# Altium schematic sheet uC_Board.SchDoc
size Legal
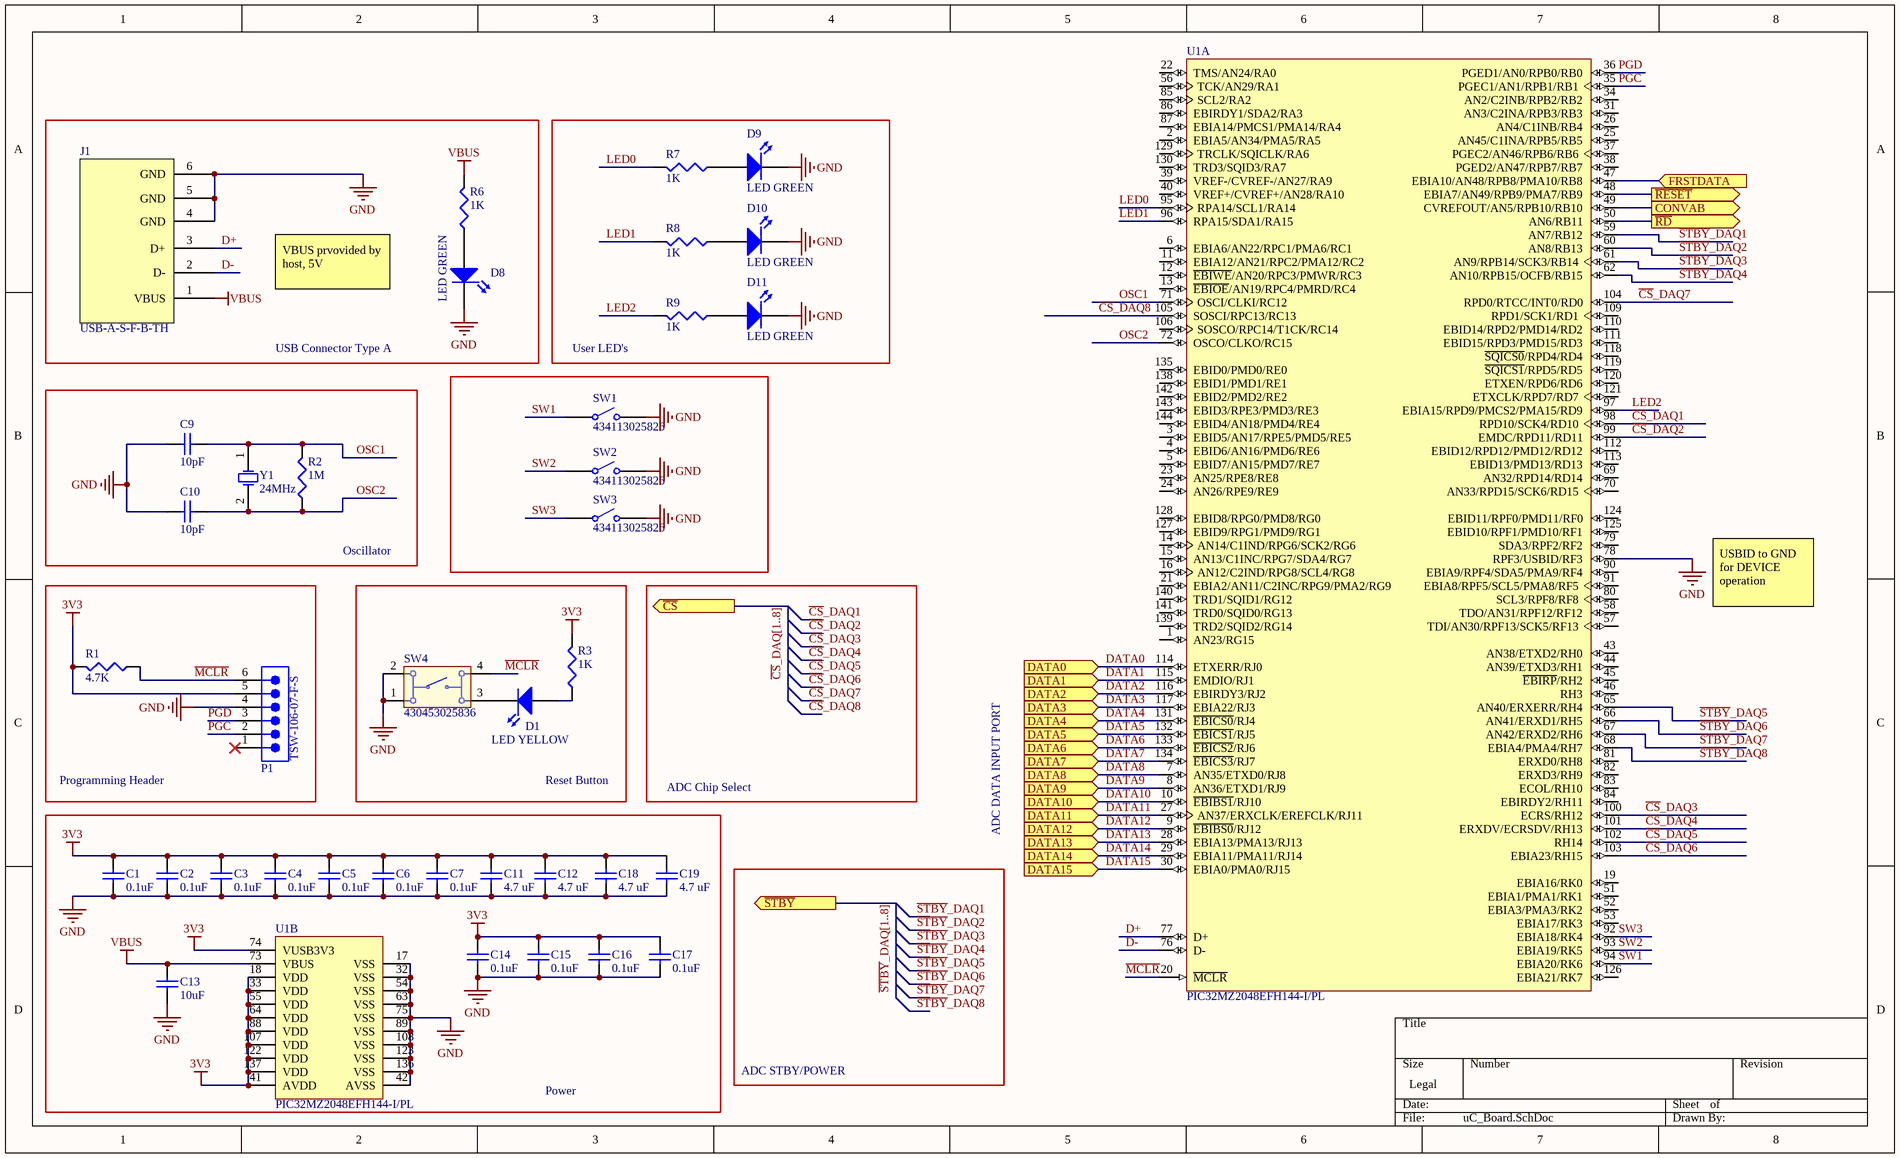
[diagram p0: uC_Board.SchDoc]

## Parts
C1  value 0.1uF  [0402]  (hidden comment: C0402)
C2  value 0.1uF  [0402]  (hidden comment: C0402)
C3  value 0.1uF  [0402]  (hidden comment: C0402)
C4  value 0.1uF  [0402]  (hidden comment: C0402)
C5  value 0.1uF  [0402]  (hidden comment: C0402)
C6  value 0.1uF  [0402]  (hidden comment: C0402)
C7  value 0.1uF  [0402]  (hidden comment: C0402)
C9  value 10pF  [0805]  (hidden comment: C0805)
C10  value 10pF  [0805]  (hidden comment: C0805)
C11  value 4.7 uF  [0603]  (hidden comment: C0603)
C12  value 4.7 uF  [0603]  (hidden comment: C0603)
C13  value 10uF  [0805]  (hidden comment: C0805)
C14  value 0.1uF  [0402]  (hidden comment: C0402)
C15  value 0.1uF  [0402]  (hidden comment: C0402)
C16  value 0.1uF  [0402]  (hidden comment: C0402)
C17  value 0.1uF  [0402]  (hidden comment: C0402)
C18  value 4.7 uF  [0603]  (hidden comment: C0603)
C19  value 4.7 uF  [0603]  (hidden comment: C0603)
D1  LED YELLOW  [C0805]
D8  LED GREEN  [C0805]
D9  LED GREEN  [C0805]
D10  LED GREEN  [C0805]
D11  LED GREEN  [C0805]
J1  USB-A-S-F-B-TH  [USB-A Connector]
P1  TSW-106-07-F-S  [SMTC-TSW-106-07-X-S]
R1  value 4.7K  [J1-0603]  (hidden comment: Res3)
R2  value 1M  [0402]  (hidden comment: Res3)
R3  value 1K  [0402]  (hidden comment: Res3)
R6  value 1K  [0402]  (hidden comment: Res3)
R7  value 1K  [0402]  (hidden comment: Res3)
R8  value 1K  [0402]  (hidden comment: Res3)
R9  value 1K  [0402]  (hidden comment: Res3)
SW1  434113025826  [434113025826]
SW2  434113025826  [434113025826]
SW3  434113025826  [434113025826]
SW4  430453025836  [430453025836]
U1  PIC32MZ2048EFH144-I/PL  [MCHP-LQFP-PL144_N]  (parts A,B of 2)
Y1  24MHz  [HC49US]

## Blocks framed on the sheet
USB Connector Type A: D8 J1 R6
User LED's: D9-D11 R7-R9
Oscillator: C9 C10 R2 Y1
Programming Header: P1 R1
Reset Button: D1 R3 SW4
Power: C1-C7 C11-C19 U1

## Ports
CONVAB (out), DATA0 (in), DATA1 (in), DATA2 (in), DATA3 (in), DATA4 (in), DATA5 (in), DATA6 (in), DATA7 (in), DATA8 (in), DATA9 (in), DATA10 (in), DATA11 (in), DATA12 (in), DATA13 (in), DATA14 (in), DATA15 (in), FRSTDATA (in), ~{CS} (out), ~{RD} (out), ~{RESET} (out), ~{STBY} (out)

## Nets
3V3: C1.2 C2.2 C3.2 C4.2 C5.2 C6.2 C7.2 C11.1 C12.1 C14.2 C15.2 C16.2 C17.2 C18.1 C19.1 P1.5 R1.2 R3.2 U1.18(VDD) U1.33(VDD) U1.41(AVDD) U1.55(VDD) U1.64(VDD) U1.74(VUSB3V3) U1.88(VDD) U1.107(VDD) U1.122(VDD) U1.137(VDD)
GND: C1.1 C2.1 C3.1 C4.1 C5.1 C6.1 C7.1 C9.1 C10.1 C11.2 C12.2 C13.1 C14.1 C15.1 C16.1 C17.1 C18.2 C19.2 D8.2(K) D9.2(K) D10.2(K) D11.2(K) J1.4(GND) J1.5(GND) J1.6(GND) P1.4 SW1.2 SW2.2 SW3.2 SW4.1 SW4.2 U1.17(VSS) U1.32(VSS) U1.42(AVSS) U1.54(VSS) U1.63(VSS) U1.75(VSS) U1.78(RPF3/USBID/RF3) U1.89(VSS) U1.108(VSS) U1.123(VSS) U1.136(VSS)
VBUS: C13.2 J1.1(VBUS) R6.2 U1.73(VBUS)
~{CS}_DAQ1: U1.98(RPD10/SCK4/RD10)
~{CS}_DAQ2: U1.99(EMDC/RPD11/RD11)
~{CS}_DAQ3: U1.100(ECRS/RH12)
~{CS}_DAQ4: U1.101(ERXDV/ECRSDV/RH13)
~{CS}_DAQ5: U1.102(RH14)
~{CS}_DAQ6: U1.103(EBIA23/RH15)
~{CS}_DAQ7: U1.104(RPD0/RTCC/INT0/RD0)
~{CS}_DAQ8: U1.105(SOSCI/RPC13/RC13)
~{CS}_DAQ[1..8]: port ~{CS}
CONVAB: U1.49(CVREFOUT/AN5/RPB10/RB10) ; port CONVAB
D+: J1.3(D+) U1.77(D+)
D-: J1.2(D-) U1.76(D-)
DATA0: U1.114(ETXERR/RJ0) ; port DATA0
DATA1: U1.115(EMDIO/RJ1) ; port DATA1
DATA2: U1.116(EBIRDY3/RJ2) ; port DATA2
DATA3: U1.117(EBIA22/RJ3) ; port DATA3
DATA4: U1.131(~{EBICS0}/RJ4) ; port DATA4
DATA5: U1.132(~{EBICS1}/RJ5) ; port DATA5
DATA6: U1.133(~{EBICS2}/RJ6) ; port DATA6
DATA7: U1.134(~{EBICS3}/RJ7) ; port DATA7
DATA8: U1.7(AN35/ETXD0/RJ8) ; port DATA8
DATA9: U1.8(AN36/ETXD1/RJ9) ; port DATA9
DATA10: U1.10(~{EBIBS1}/RJ10) ; port DATA10
DATA11: U1.27(AN37/ERXCLK/EREFCLK/RJ11) ; port DATA11
DATA12: U1.9(~{EBIBS0}/RJ12) ; port DATA12
DATA13: U1.28(EBIA13/PMA13/RJ13) ; port DATA13
DATA14: U1.29(EBIA11/PMA11/RJ14) ; port DATA14
DATA15: U1.30(EBIA0/PMA0/RJ15) ; port DATA15
FRSTDATA: U1.47(EBIA10/AN48/RPB8/PMA10/RB8) ; port FRSTDATA
LED0: R7.2 U1.95(RPA14/SCL1/RA14)
LED1: R8.2 U1.96(RPA15/SDA1/RA15)
LED2: R9.2 U1.97(EBIA15/RPD9/PMCS2/PMA15/RD9)
~{MCLR}: P1.6 R1.1 SW4.4 U1.20(~{MCLR})
OSC1: C9.2 R2.2 U1.71(OSCI/CLKI/RC12) Y1.1(OSC1)
OSC2: C10.2 R2.1 U1.72(OSCO/CLKO/RC15) Y1.2(OSC2)
PGC: P1.2 U1.35(PGEC1/AN1/RPB1/RB1)
PGD: P1.3 U1.36(PGED1/AN0/RPB0/RB0)
~{RD}: U1.50(AN6/RB11) ; port ~{RD}
~{RESET}: U1.48(EBIA7/AN49/RPB9/PMA7/RB9) ; port ~{RESET}
~{STBY}_DAQ1: U1.59(AN7/RB12)
~{STBY}_DAQ2: U1.60(AN8/RB13)
~{STBY}_DAQ3: U1.61(AN9/RPB14/SCK3/RB14)
~{STBY}_DAQ4: U1.62(AN10/RPB15/OCFB/RB15)
~{STBY}_DAQ5: U1.65(AN40/ERXERR/RH4)
~{STBY}_DAQ6: U1.66(AN41/ERXD1/RH5)
~{STBY}_DAQ7: U1.67(AN42/ERXD2/RH6)
~{STBY}_DAQ8: U1.68(EBIA4/PMA4/RH7)
SW1: SW1.1 U1.94(EBIA20/RK6)
SW2: SW2.1 U1.93(EBIA19/RK5)
SW3: SW3.1 U1.92(EBIA18/RK4)
NetD1_1: D1.1(A) R3.1
NetD1_2: D1.2(K) SW4.3
NetD8_1: D8.1(A) R6.1
NetD9_1: D9.1(A) R7.1
NetD10_1: D10.1(A) R8.1
NetD11_1: D11.1(A) R9.1

Not connected (* = marked no-connect by the designer): P1 1*; U1 1(AN23/RG15) 2(EBIA5/AN34/PMA5/RA5) 3(EBID5/AN17/RPE5/PMD5/RE5) 4(EBID6/AN16/PMD6/RE6) 5(EBID7/AN15/PMD7/RE7) 6(EBIA6/AN22/RPC1/PMA6/RC1) 11(EBIA12/AN21/RPC2/PMA12/RC2) 12(~{EBIWE}/AN20/RPC3/PMWR/RC3) 13(~{EBIOE}/AN19/RPC4/PMRD/RC4) 14(AN14/C1IND/RPG6/SCK2/RG6) 15(AN13/C1INC/RPG7/SDA4/RG7) 16(AN12/C2IND/RPG8/SCL4/RG8) 19(EBIA16/RK0) 21(EBIA2/AN11/C2INC/RPG9/PMA2/RG9) 22(TMS/AN24/RA0) 23(AN25/RPE8/RE8) 24(AN26/RPE9/RE9) 25(AN45/C1INA/RPB5/RB5) 26(AN4/C1INB/RB4) 31(AN3/C2INA/RPB3/RB3) 34(AN2/C2INB/RPB2/RB2) 37(PGEC2/AN46/RPB6/RB6) 38(PGED2/AN47/RPB7/RB7) 39(VREF-/CVREF-/AN27/RA9) 40(VREF+/CVREF+/AN28/RA10) 43(AN38/ETXD2/RH0) 44(AN39/ETXD3/RH1) 45(~{EBIRP}/RH2) 46(RH3) 51(EBIA1/PMA1/RK1) 52(EBIA3/PMA3/RK2) 53(EBIA17/RK3) 56(TCK/AN29/RA1) 57(TDI/AN30/RPF13/SCK5/RF13) 58(TDO/AN31/RPF12/RF12) 69(AN32/RPD14/RD14) 70(AN33/RPD15/SCK6/RD15) 79(SDA3/RPF2/RF2) 80(SCL3/RPF8/RF8) 81(ERXD0/RH8) 82(ERXD3/RH9) 83(ECOL/RH10) 84(EBIRDY2/RH11) 85(SCL2/RA2) 86(EBIRDY1/SDA2/RA3) 87(EBIA14/PMCS1/PMA14/RA4) 90(EBIA9/RPF4/SDA5/PMA9/RF4) 91(EBIA8/RPF5/SCL5/PMA8/RF5) 106(SOSCO/RPC14/T1CK/RC14) 109(RPD1/SCK1/RD1) 110(EBID14/RPD2/PMD14/RD2) 111(EBID15/RPD3/PMD15/RD3) 112(EBID12/RPD12/PMD12/RD12) 113(EBID13/PMD13/RD13) 118(~{SQICS0}/RPD4/RD4) 119(~{SQICS1}/RPD5/RD5) 120(ETXEN/RPD6/RD6) 121(ETXCLK/RPD7/RD7) 124(EBID11/RPF0/PMD11/RF0) 125(EBID10/RPF1/PMD10/RF1) 126(EBIA21/RK7) 127(EBID9/RPG1/PMD9/RG1) 128(EBID8/RPG0/PMD8/RG0) 129(TRCLK/SQICLK/RA6) 130(TRD3/SQID3/RA7) 135(EBID0/PMD0/RE0) 138(EBID1/PMD1/RE1) 139(TRD2/SQID2/RG14) 140(TRD1/SQID1/RG12) 141(TRD0/SQID0/RG13) 142(EBID2/PMD2/RE2) 143(EBID3/RPE3/PMD3/RE3) 144(EBID4/AN18/PMD4/RE4)

## Buses and harness runs
bus ~{STBY}_DAQ[1..8]

## Notes on the sheet
- VBUS prvovided by host, 5V
- USBID to GND for DEVICE operation
- ADC Chip Select
- ADC DATA INPUT PORT
- ADC STBY/POWER

## Library data of the parts
C1-C7 C14-C17 = C0402: Ceramic Chip Capacitor - Standard; Note: Footprint corresponds to dimensions for bulk cassette packaging. This case size has tightened tolerances.; Published: 17-Jul-2002; LatestRevisionDate: 19-Mar-2004; LatestRevisionNote: Silkscreen size reduced.; DatasheetDocument: Mar-2001; PackageDocument: Mar-2001; PackageReference: 0402; Publisher: Altium Limited; Code_JEITA: 0402; Code_IPC: 1005 [0402]; ComponentLink1Description: Manufacturer Link; ComponentLink1URL: http://www.kemet.com/; ComponentLink2Description: Datasheet; ComponentLink2URL: http://www.kemet.com/kemet/web/homepage/kechome.nsf/vapubfilesname/F3102TA.pdf/$file/F3102TA.pdf; Supplier Part Number 1: 399-7332-1-ND; Supplier 1: Digikey
C9 C10 C13 = C0805: Ceramic Chip Capacitor - Standard; Note: Footprint corresponds to dimensions for bulk cassette packaging. This case size has tightened tolerances.; Published: 17-Jul-2002; LatestRevisionDate: 19-Mar-2004; LatestRevisionNote: Silkscreen size reduced.; DatasheetDocument: Mar-2001; PackageDocument: Mar-2001; PackageReference: 0805; Publisher: Altium Limited; Code_JEITA: 0805; Code_IPC: 2012[0805]; ComponentLink1Description: Manufacturer Link; ComponentLink1URL: http://www.kemet.com/; ComponentLink2Description: Datasheet; ComponentLink2URL: http://www.kemet.com/kemet/web/homepage/kechome.nsf/vapubfilesname/F3102TA.pdf/$file/F3102TA.pdf; Supplier 1: Digikey
  C9 C10: Supplier Part Number 1: 399-9987-1-ND
  C13: Supplier Part Number 1: 490-6473-1-ND
C11 C12 C18 C19 = C0603: Ceramic Chip Capacitor - Standard; Note: Footprint corresponds to dimensions for bulk cassette packaging. This case size has tightened tolerances.; Published: 17-Jul-2002; LatestRevisionDate: 19-Mar-2004; LatestRevisionNote: Silkscreen size reduced.; DatasheetDocument: Mar-2001; PackageDocument: Mar-2001; PackageReference: 0603; Publisher: Altium Limited; Code_JEITA: 0603; Code_IPC: 1608 [0603]; ComponentLink1Description: Manufacturer Link; ComponentLink1URL: http://www.kemet.com/; ComponentLink2Description: Datasheet; ComponentLink2URL: http://www.kemet.com/kemet/web/homepage/kechome.nsf/vapubfilesname/F3102TA.pdf/$file/F3102TA.pdf; Supplier Part Number 1: 445-7478-1-ND; Supplier 1: Digikey
D1 = LED_YELLOW: Red LED; SMD 0805; Supplier 1: Digikey; Supplier Part Number 1: 67-1558-1-ND
D8-D11 = LED_GREEN: Green LED; SMD 0805; Supplier Part Number 1: 67-1557-1-ND; Supplier 1: Digikey
J1 = USB-A Connector: USB-A Connector- Through Hole; Supplier 1: Samtec; Supplier Part Number 1: USB-A-S-F-B-TH
P1 = TSW-106-07-F-S: 0.025" SQ Post Header, Through-hole, Vertical, -55 to 125 degC, 2.54 mm Pitch, 6-Pin, Male, RoHS; Manufacturer: Samtec; Pitch: 2.54 mm; DatasheetVersion: F-214; PackageVersion: DM, 8/1988; PackageReference: TSW-106-07-X-S; PackageDescription: .025[0.64] SQ. Post Terminal Strip Assembly; Supplier 1: Digi-Key; Supplier Part Number 1: TSW-106-07-F-S-ND; Orientation: Vertical; RoHS: True; Temperature Range: -55 to 125 degC; Mounting Technology: Through-hole; PartNumber: TSW-106-07-F-S; ComponentLink1Description: Manufacturer URL; ComponentLink1URL: http://www.samtec.com; ComponentLink2Description: Datasheet; ComponentLink2URL: http://www.samtec.com/documents/webfiles/pdf/TSW_TH.PDF; ComponentLink3Description: Package Specification; ComponentLink3URL: http://www.samtec.com/documents/webfiles/cpdf/TSW-XXX-XX-XXX-X-XX-XXX-MKT.pdf
R1-R3 R6-R9 = Res3: Resistor; Published: 8-Jun-2000; LatestRevisionDate: 29-May-2009; LatestRevisionNote: IPC-7351 Footprint Added.; PackageReference: J1-0603; Publisher: Altium Limited; PackageDescription: Chip Resistor; Supplier: Digikey
  R1: Supplier Part Number 1: 311-4.7KGRCT-ND
  R2: Supplier Part Number 1: 541-1.0MAVCT-ND
  R3 R6-R9: Supplier Part Number 1: 311-1.00KLRCT-ND
SW1-SW3 = 434113025826: WS-TASV J-Bend SMD Tact Switch 6.0X3.8 mm; NoPins: 02; PackageReference: 434113025826; PartNumber: 434113025826; ComponentLink1Description: Manufacturer URL; ComponentLink1URL: http://www.we-online.com; ComponentLink2Description: Datasheet; ComponentLink2URL: http://katalog.we-online.de/em/datasheet/434113025826.pdf; Supplier 1: Digikey; Supplier Part Number 1: 732-7042-1-ND
SW4 = 430453025836: WS-TASV J-Bend SMD Tact Switch 6X6 mm; NoPins: 04; PackageReference: 430453025836; Supplier Part Number 1: 732-7013-1-ND; ComponentLink1Description: Manufacturer URL; ComponentLink1URL: http://www.we-online.com; ComponentLink2Description: Datasheet; ComponentLink2URL: http://katalog.we-online.de/em/datasheet/4304x3.pdf; Supplier 1: Digikey
U1 = PIC32MZ2048ECH144-I/PL: 32-Bit Microcontroller with Audio and Graphics Interfaces, HS USB, Ethernet, and Advanced Analog, 2048 KB Program Memory, 120 I/O Pins, PMP, Industrial Temperature, 144-Pin LQFP (PL144), Tray; Manufacturer: Microchip; VCC Range: 2.2 to 3.6 V; DatasheetVersion: Rev. B; PackageVersion: C04-044B, 12/2012; PackageReference: LQFP-PL144; PackageDescription: 144-Lead Plastic Low Profile Quad Flatpack, 20 x 20 mm Body, 0.5 mm Pitch; Supplier 1: Digi-Key; Supplier Part Number 1: PIC32MZ2048ECH144-I/PL-ND; Supplier 2: Newark; Supplier Part Number 2: 17X9365; Supplier 3: Mouser; Supplier Part Number 3: 579-2048ECH144-I/PL; Packing: Tray; Mounting Technology: Surface Mount; PartNumber: PIC32MZ2048EFH144-I/PL; ComponentLink1Description: Manufacturer URL; ComponentLink1URL: http://www.microchip.com/; ComponentLink2Description: Datasheet; ComponentLink2URL: http://ww1.microchip.com/downloads/en/DeviceDoc/60001191B.pdf; ComponentLink3Description: Package Specification; ComponentLink3URL: http://www.microchip.com/stellent/groups/techpub_sg/documents/packagingspec/en012702.pdf
Y1 = XTAL: Crystal Oscillator; Published: 8-Jun-2000; LatestRevisionDate: 17-Jul-2002; LatestRevisionNote: Re-released for DXP Platform.; PackageReference: HC49US; Publisher: Altium Limited; PackageDescription: Crystal; SMD HC49US; Supplier Part Number 1: 300-6145-1-ND; Supplier 1: Digikey